# EAGLE schematic ext_power_M (EAGLE 9.6.2)
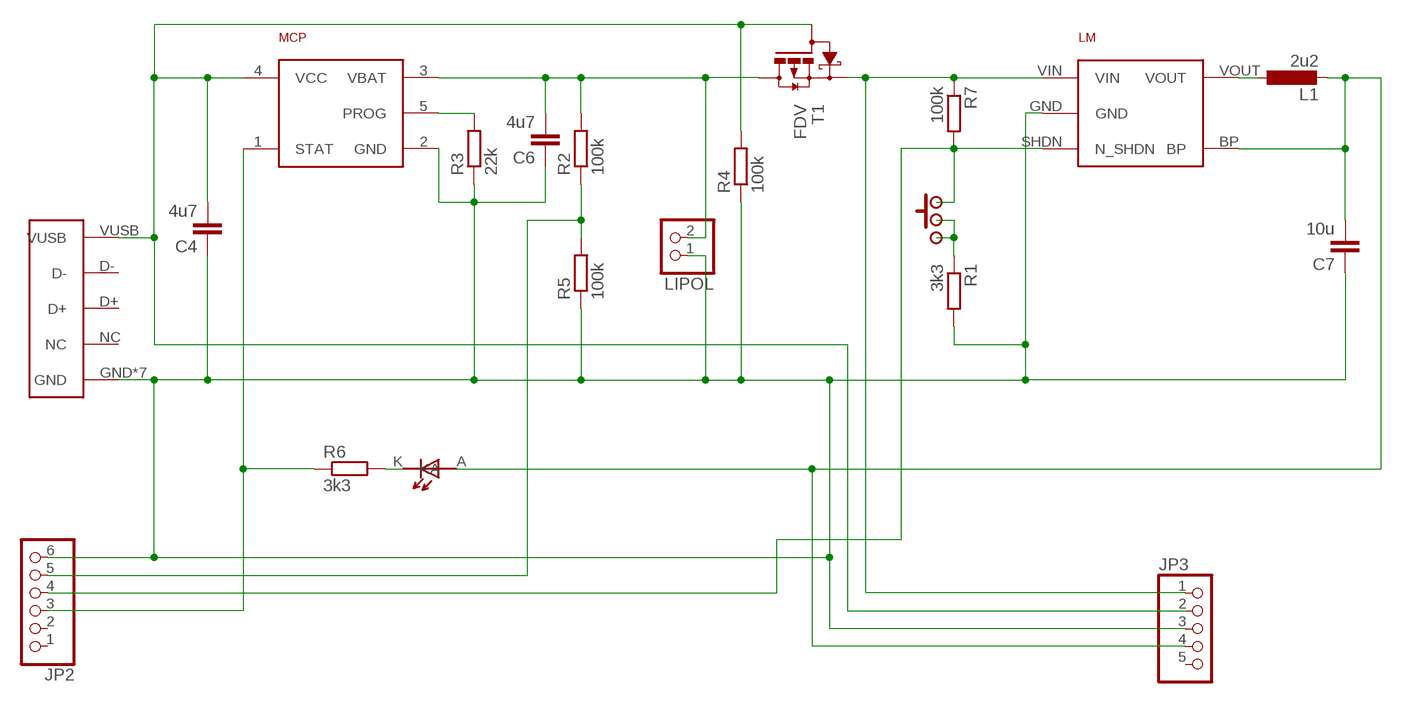
[diagram p0: schematic, sheet 1]

## Parts
C4  4u7  C-EUC0603  [C0603]
C6  4u7  C-EUC0603  [C0603]
C7  10u  C-EUC0603  [C0603]
D1  LED1.8  [LED1.8]
JP2  PINHD-1X6  [1X06]
JP3  PINHD-1X5  [1X05]
L1  2u2  L-EUL3230M  [L3230M]
LIPOL  PINHD-1X2  [1X02]
LM  TC  STABILISER_APE8865  [SOT32-5]
MCP  MCP  MCP73831  [SOT23-5]
ON/OFF/RESET  SWITCH  [SWITCH]
R1  3k3  R-EU_R0603  [R0603]
R2  100k  R-EU_R0603  [R0603]
R3  22k  R-EU_R0603  [R0603]
R4  100k  R-EU_R0603  [R0603]
R5  100k  R-EU_R0603  [R0603]
R6  3k3  R-EU_R0603  [R0603]
R7  100k  R-EU_R0603  [R0603]
T1  FDV  P-MOSFET-FDV304P  [SOT23]
USB  MICRO-USB  [MICRO-USB]

## Nets
GND: C4.1 C6.1 C7.1 JP2.6 JP3.3 LIPOL.1 LM.GND MCP.2(GND) R1.2 R3.1 R4.1 R5.1 USB.GND USB.GND1(GND) USB.GND2(GND) USB.GND3(GND) USB.GND4(GND) USB.P$1(GND) USB.P$2(GND)
N$1: ON/OFF/RESET.P$2 ON/OFF/RESET.P$3 ON/OFF/RESET.P$5 R1.1
N$2: L1.1 LM.VOUT
N$3: D1.K R6.2
N$5: JP2.5 R2.1 R5.2
N$8: C6.2 LIPOL.2 MCP.3(VBAT) R2.2 T1.D
N$9: C4.2 JP3.2 MCP.4(VCC) R4.2 T1.G USB.VUSB
N$11: MCP.5(PROG) R3.2
N$12: JP3.1 LM.VIN R7.1 T1.S
N$20: JP2.4 LM.SHDN(N_SHDN) ON/OFF/RESET.P$1 ON/OFF/RESET.P$4 R7.2
PA7: JP2.3 MCP.1(STAT) R6.1
VDD: C7.2 D1.A JP3.4 L1.2 LM.BP
Unconnected: JP2.1 JP2.2 JP3.5 USB.D+ USB.D- USB.NC

## Library data of the parts
C4 C6 C7 = rcl:C-EU: CAPACITOR, European symbol; SPICEPREFIX: C
D1 = !stavebnice03:LED1.8
JP2 = pinhead2:PINHD-1X6: PIN HEADER
JP3 = pinhead2:PINHD-1X5: PIN HEADER
L1 = rcl:L-EU: INDUCTOR, European symbol; SPICEPREFIX: L
LIPOL = pinhead2:PINHD-1X2: PIN HEADER
LM = !stavebnice03:STABILISER_APE8865
MCP = !stavebnice03:MCP73831
ON/OFF/RESET = hugo:SWITCH
R1-R7 = rcl:R-EU_: RESISTOR, European symbol; SPICEPREFIX: R
T1 = !stavebnice03:P-MOSFET-FDV304P
USB = hugo:MICRO-USB